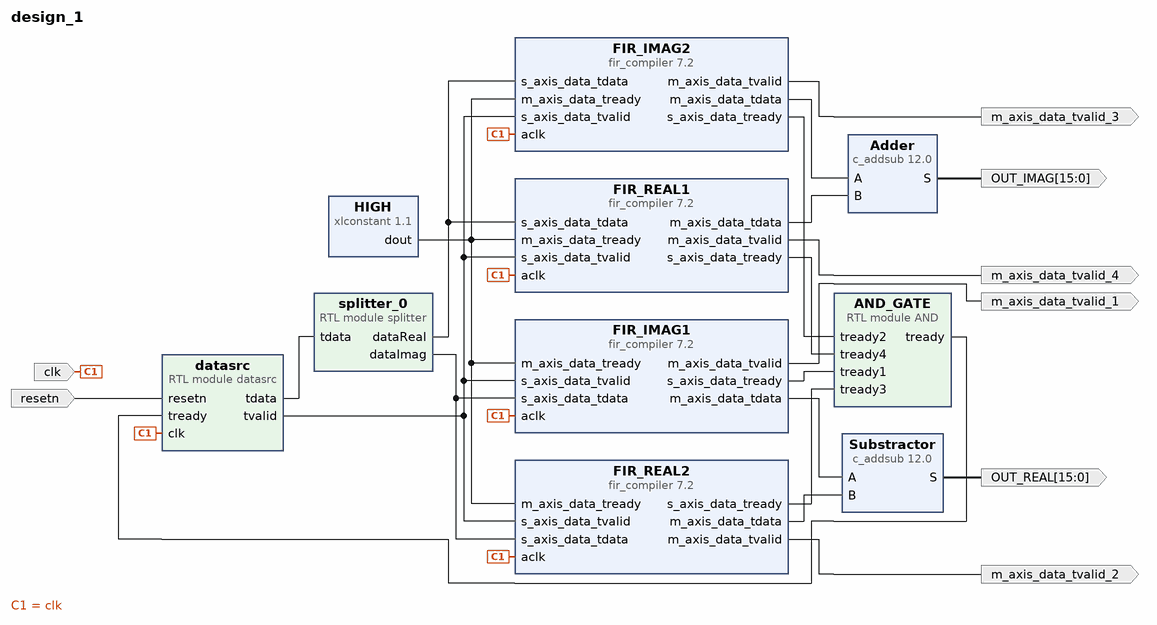
[diagram p0: block diagram of the top level]
# Vivado block design design_1, xc7z020clg484-1, Vivado 2020.2
create_bd_design design_1

create_bd_port -dir I -type clk clk
create_bd_port -dir O -from 15 -to 0 -type data OUT_IMAG
create_bd_port -dir O -from 15 -to 0 -type data OUT_REAL
create_bd_port -dir O m_axis_data_tvalid_4
create_bd_port -dir O m_axis_data_tvalid_3
create_bd_port -dir O m_axis_data_tvalid_2
create_bd_port -dir O m_axis_data_tvalid_1
create_bd_port -dir I -type rst resetn

create_bd_cell -type ip -vlnv xilinx.com:ip:fir_compiler:7.2 FIR_IMAG1
set_property -dict [list \
  CONFIG.Clock_Frequency 300.0 \
  CONFIG.CoefficientSource COE_File \
  CONFIG.Coefficient_File ../../../../../../ExternalFiles/matchedFiltering_imag.coe \
  CONFIG.Coefficient_Fractional_Bits 0 \
  CONFIG.Coefficient_Sets 1 \
  CONFIG.Coefficient_Sign Signed \
  CONFIG.Coefficient_Structure Inferred \
  CONFIG.Coefficient_Width 16 \
  CONFIG.Data_Fractional_Bits 8 \
  CONFIG.Data_Width 16 \
  CONFIG.Filter_Architecture Systolic_Multiply_Accumulate \
  CONFIG.Filter_Selection 1 \
  CONFIG.M_DATA_Has_TREADY true \
  CONFIG.Number_Paths 1 \
  CONFIG.Output_Rounding_Mode Truncate_LSBs \
  CONFIG.Output_Width 16 \
  CONFIG.Quantization Integer_Coefficients \
  CONFIG.Sample_Frequency 0.001 \
] [get_bd_cells FIR_IMAG1]
create_bd_cell -type ip -vlnv xilinx.com:ip:fir_compiler:7.2 FIR_REAL1
set_property -dict [list \
  CONFIG.Clock_Frequency 300.0 \
  CONFIG.CoefficientSource COE_File \
  CONFIG.Coefficient_File ../../../../../../ExternalFiles/matchedFiltering_real.coe \
  CONFIG.Coefficient_Fractional_Bits 0 \
  CONFIG.Coefficient_Sets 1 \
  CONFIG.Coefficient_Sign Signed \
  CONFIG.Coefficient_Structure Inferred \
  CONFIG.Coefficient_Width 16 \
  CONFIG.Data_Fractional_Bits 8 \
  CONFIG.Data_Width 16 \
  CONFIG.Filter_Architecture Systolic_Multiply_Accumulate \
  CONFIG.Filter_Selection 1 \
  CONFIG.M_DATA_Has_TREADY true \
  CONFIG.Number_Paths 1 \
  CONFIG.Output_Rounding_Mode Truncate_LSBs \
  CONFIG.Output_Width 16 \
  CONFIG.Quantization Integer_Coefficients \
  CONFIG.Sample_Frequency 0.001 \
] [get_bd_cells FIR_REAL1]
create_bd_cell -type ip -vlnv xilinx.com:ip:fir_compiler:7.2 FIR_IMAG2
set_property -dict [list \
  CONFIG.Clock_Frequency 300.0 \
  CONFIG.CoefficientSource COE_File \
  CONFIG.Coefficient_File ../../../../../../ExternalFiles/matchedFiltering_imag.coe \
  CONFIG.Coefficient_Fractional_Bits 0 \
  CONFIG.Coefficient_Sets 1 \
  CONFIG.Coefficient_Sign Signed \
  CONFIG.Coefficient_Structure Inferred \
  CONFIG.Coefficient_Width 16 \
  CONFIG.Data_Fractional_Bits 8 \
  CONFIG.Data_Width 16 \
  CONFIG.Filter_Architecture Systolic_Multiply_Accumulate \
  CONFIG.Filter_Selection 1 \
  CONFIG.M_DATA_Has_TREADY true \
  CONFIG.Number_Paths 1 \
  CONFIG.Output_Rounding_Mode Truncate_LSBs \
  CONFIG.Output_Width 16 \
  CONFIG.Quantization Integer_Coefficients \
  CONFIG.Sample_Frequency 0.001 \
] [get_bd_cells FIR_IMAG2]
create_bd_cell -type ip -vlnv xilinx.com:ip:fir_compiler:7.2 FIR_REAL2
set_property -dict [list \
  CONFIG.Clock_Frequency 300.0 \
  CONFIG.CoefficientSource COE_File \
  CONFIG.Coefficient_File ../../../../../../ExternalFiles/matchedFiltering_real.coe \
  CONFIG.Coefficient_Fractional_Bits 0 \
  CONFIG.Coefficient_Sets 1 \
  CONFIG.Coefficient_Sign Signed \
  CONFIG.Coefficient_Structure Inferred \
  CONFIG.Coefficient_Width 16 \
  CONFIG.Data_Fractional_Bits 8 \
  CONFIG.Data_Width 16 \
  CONFIG.Filter_Architecture Systolic_Multiply_Accumulate \
  CONFIG.Filter_Selection 1 \
  CONFIG.M_DATA_Has_TREADY true \
  CONFIG.Number_Paths 1 \
  CONFIG.Output_Rounding_Mode Truncate_LSBs \
  CONFIG.Output_Width 16 \
  CONFIG.Quantization Integer_Coefficients \
  CONFIG.Sample_Frequency 0.001 \
] [get_bd_cells FIR_REAL2]
create_bd_cell -type module -reference datasrc datasrc
create_bd_cell -type module -reference splitter splitter_0
create_bd_cell -type module -reference AND AND_GATE
create_bd_cell -type ip -vlnv xilinx.com:ip:xlconstant:1.1 HIGH
create_bd_cell -type ip -vlnv xilinx.com:ip:c_addsub:12.0 Substractor
set_property -dict [list \
  CONFIG.A_Width 16 \
  CONFIG.Add_Mode Subtract \
  CONFIG.B_Value 0000000000000000 \
  CONFIG.B_Width 16 \
  CONFIG.CE false \
  CONFIG.Latency 0 \
  CONFIG.Out_Width 16 \
] [get_bd_cells Substractor]
create_bd_cell -type ip -vlnv xilinx.com:ip:c_addsub:12.0 Adder
set_property -dict [list \
  CONFIG.A_Width 16 \
  CONFIG.B_Value 0000000000000000 \
  CONFIG.B_Width 16 \
  CONFIG.CE false \
  CONFIG.Latency 0 \
  CONFIG.Out_Width 16 \
] [get_bd_cells Adder]

# ---- connections ----

connect_bd_net [get_bd_pins datasrc/tdata] [get_bd_pins splitter_0/tdata]
connect_bd_net [get_bd_pins splitter_0/dataImag] [get_bd_pins FIR_IMAG1/s_axis_data_tdata] [get_bd_pins FIR_REAL2/s_axis_data_tdata]
connect_bd_net [get_bd_pins splitter_0/dataReal] [get_bd_pins FIR_IMAG2/s_axis_data_tdata] [get_bd_pins FIR_REAL1/s_axis_data_tdata]
connect_bd_net -net clk_0_1 [get_bd_ports clk] \
  [get_bd_pins datasrc/clk] [get_bd_pins FIR_IMAG1/aclk] [get_bd_pins FIR_REAL2/aclk] [get_bd_pins FIR_IMAG2/aclk] \
  [get_bd_pins FIR_REAL1/aclk]
connect_bd_net [get_bd_pins datasrc/tvalid] \
  [get_bd_pins FIR_IMAG2/s_axis_data_tvalid] [get_bd_pins FIR_REAL1/s_axis_data_tvalid] \
  [get_bd_pins FIR_REAL2/s_axis_data_tvalid] [get_bd_pins FIR_IMAG1/s_axis_data_tvalid]
connect_bd_net -net AND_0_tready [get_bd_pins AND_GATE/tready] [get_bd_pins datasrc/tready]
connect_bd_net [get_bd_pins FIR_IMAG1/s_axis_data_tready] [get_bd_pins AND_GATE/tready1]
connect_bd_net [get_bd_pins FIR_IMAG2/s_axis_data_tready] [get_bd_pins AND_GATE/tready2]
connect_bd_net [get_bd_pins FIR_REAL2/s_axis_data_tready] [get_bd_pins AND_GATE/tready3]
connect_bd_net [get_bd_pins FIR_REAL1/s_axis_data_tready] [get_bd_pins AND_GATE/tready4]
connect_bd_net -net xlconstant_0_dout [get_bd_pins HIGH/dout] \
  [get_bd_pins FIR_REAL2/m_axis_data_tready] [get_bd_pins FIR_IMAG1/m_axis_data_tready] \
  [get_bd_pins FIR_IMAG2/m_axis_data_tready] [get_bd_pins FIR_REAL1/m_axis_data_tready]
connect_bd_net [get_bd_pins FIR_IMAG1/m_axis_data_tdata] [get_bd_pins Substractor/A]
connect_bd_net [get_bd_pins FIR_REAL2/m_axis_data_tdata] [get_bd_pins Substractor/B]
connect_bd_net [get_bd_pins FIR_IMAG2/m_axis_data_tdata] [get_bd_pins Adder/A]
connect_bd_net [get_bd_pins FIR_REAL1/m_axis_data_tdata] [get_bd_pins Adder/B]
connect_bd_net -net c_addsub_1_S [get_bd_pins Adder/S] [get_bd_ports OUT_IMAG]
connect_bd_net -net c_addsub_0_S [get_bd_pins Substractor/S] [get_bd_ports OUT_REAL]
connect_bd_net [get_bd_pins FIR_REAL1/m_axis_data_tvalid] [get_bd_ports m_axis_data_tvalid_4]
connect_bd_net [get_bd_pins FIR_IMAG2/m_axis_data_tvalid] [get_bd_ports m_axis_data_tvalid_3]
connect_bd_net [get_bd_pins FIR_REAL2/m_axis_data_tvalid] [get_bd_ports m_axis_data_tvalid_2]
connect_bd_net [get_bd_pins FIR_IMAG1/m_axis_data_tvalid] [get_bd_ports m_axis_data_tvalid_1]
connect_bd_net -net resetn_0_1 [get_bd_ports resetn] [get_bd_pins datasrc/resetn]

validate_bd_design
save_bd_design
